# EAGLE schematic Piezo-Pulse-Sensor (EAGLE 8.4.1)
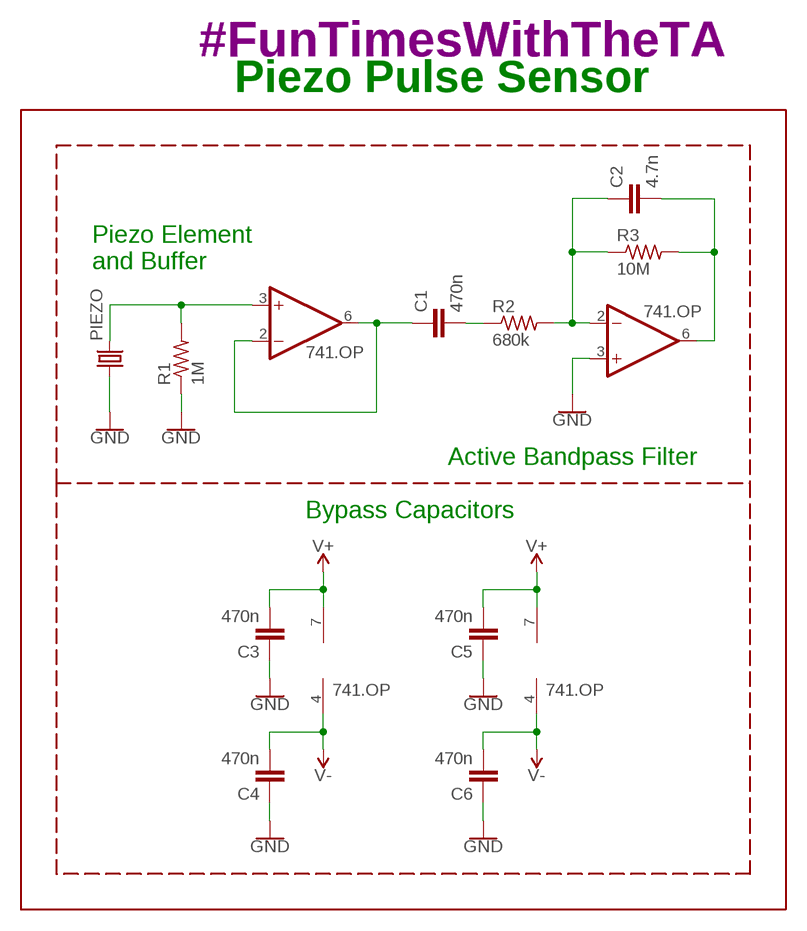
[diagram p0: schematic, sheet 1]

## Parts
C1  470n  CAPACITOR0402  [C0402]
C2  4.7n  CAPACITOR0402  [C0402]
C3  470n  CAPACITOR0402  [C0402]
C4  470n  CAPACITOR0402  [C0402]
C5  470n  CAPACITOR0402  [C0402]
C6  470n  CAPACITOR0402  [C0402]
OP1  741.OP  [DIL08]
OP2  741.OP  [DIL08]
PIEZO  PIEZO-LEADED  [VIA]
R1  1M  RESISTOR0402  [R0402]
R2  680k  RESISTOR0402  [R0402]
R3  10M  RESISTOR0402  [R0402]

## Nets
GND: C3.1 C4.1 C5.1 C6.1 OP2.3(+IN) PIEZO.1 R1.1
N$1: OP1.3(+IN) PIEZO.2 R1.2
N$2: C1.1 OP1.2(-IN) OP1.6(OUT)
N$3: C2.1 OP2.2(-IN) R2.2 R3.1
N$4: C1.2 R2.1
N$6: C2.2 OP2.6(OUT) R3.2
V+: C3.2 C5.2 OP1.7(V+) OP2.7(V+)
V-: C4.2 C6.2 OP1.4(V-) OP2.4(V-)

## Notes on the sheet
- #FunTimesWithTheTA
- Piezo Pulse Sensor
- Piezo Element
  and Buffer
- Active Bandpass Filter
- Bypass Capacitors

## Library data of the parts
C1-C6 = CalvEngIO-Passives:CAPACITOR
OP1 OP2 = CalvEngIO-AnalogIC:741.OP
PIEZO = Orlando:PIEZO-LEADED
R1-R3 = CalvEngIO-Passives:RESISTOR